# EAGLE design ps2 (EAGLE 7.6.0)
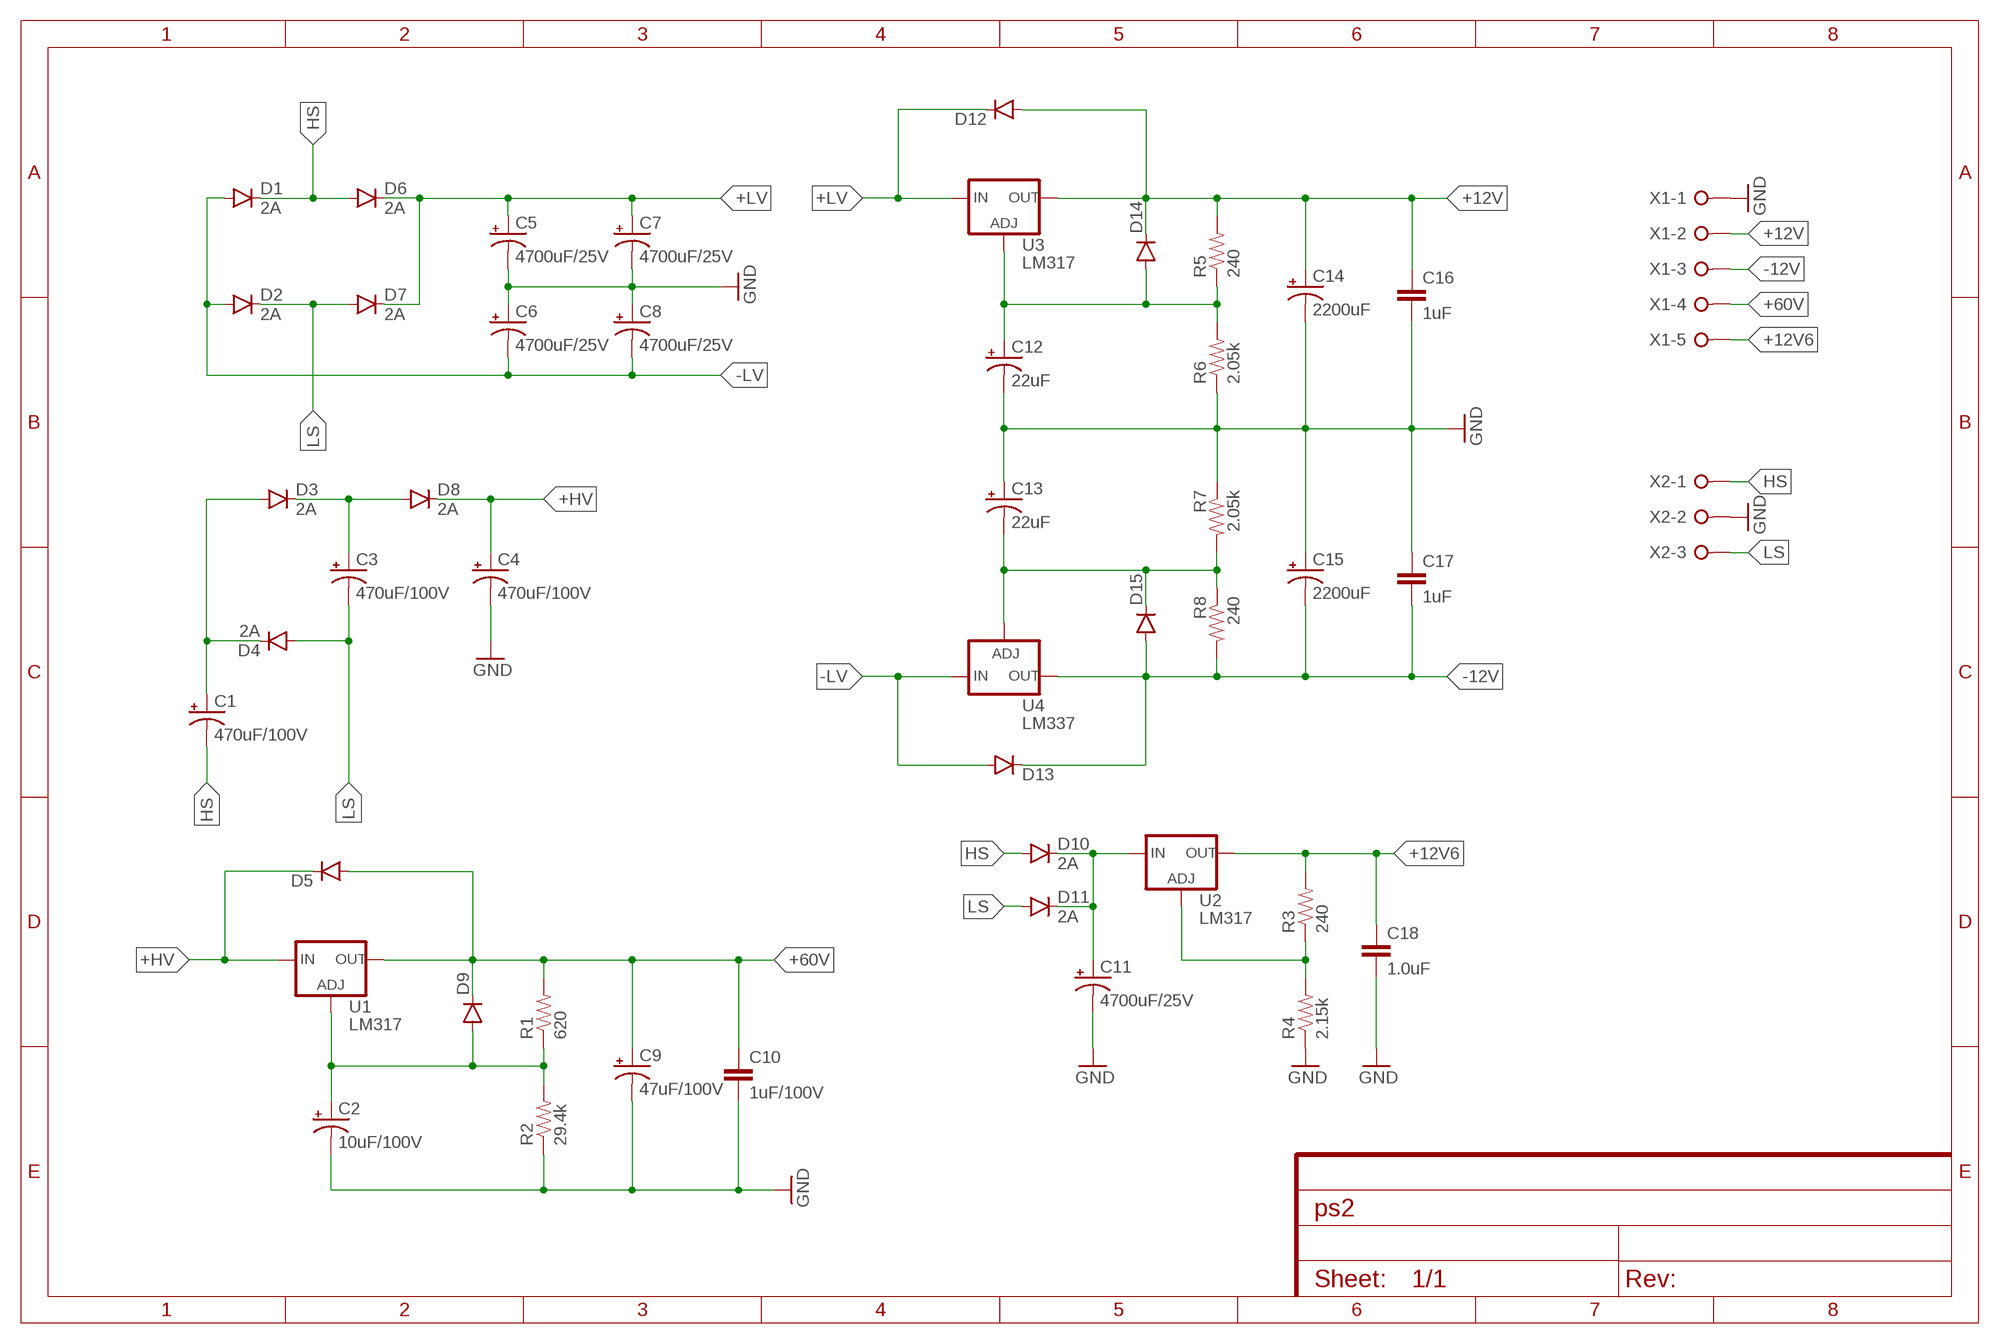
[diagram p0: schematic, sheet 1]

## Parts
C1  470uF/100V  CAP_POLPTH3  [CPOL-RADIAL-1000UF-63V]
C2  10uF/100V  CAP_POLPTH1  [CPOL-RADIAL-100UF-25V]
C3  470uF/100V  CAP_POLPTH3  [CPOL-RADIAL-1000UF-63V]
C4  470uF/100V  CAP_POLPTH3  [CPOL-RADIAL-1000UF-63V]
C5  4700uF/25V  CAP_POLPTH3  [CPOL-RADIAL-1000UF-63V]
C6  4700uF/25V  CAP_POLPTH3  [CPOL-RADIAL-1000UF-63V]
C7  4700uF/25V  CAP_POLPTH3  [CPOL-RADIAL-1000UF-63V]
C8  4700uF/25V  CAP_POLPTH3  [CPOL-RADIAL-1000UF-63V]
C9  47uF/100V  CAP_POLPTH4  [CPOL-RADIAL-1000UF-25V]
C10  1uF/100V  C-EUC1206  [C1206]
C11  4700uF/25V  CAP_POLPTH3  [CPOL-RADIAL-1000UF-63V]
C12  22uF  CAP_POLPTH2  [CPOL-RADIAL-10UF-25V]
C13  22uF  CAP_POLPTH2  [CPOL-RADIAL-10UF-25V]
C14  2200uF  CAP_POLPTH4  [CPOL-RADIAL-1000UF-25V]
C15  2200uF  CAP_POLPTH4  [CPOL-RADIAL-1000UF-25V]
C16  1uF  1UF-25V-10%(0805)"  [0805-CAP]
C17  1uF  1UF-25V-10%(0805)"  [0805-CAP]
C18  1.0uF  1.0UF-25V-+80/-20(0805)"  [0805-CAP]
D1  2A  DIODESMA  [SMA-DIODE]
D2  2A  DIODESMA  [SMA-DIODE]
D3  2A  DIODESMA  [SMA-DIODE]
D4  2A  DIODESMA  [SMA-DIODE]
D5  DIODESMA  [SMA-DIODE]
D6  2A  DIODESMA  [SMA-DIODE]
D7  2A  DIODESMA  [SMA-DIODE]
D8  2A  DIODESMA  [SMA-DIODE]
D9  DIODESMA  [SMA-DIODE]
D10  2A  DIODESMA  [SMA-DIODE]
D11  2A  DIODESMA  [SMA-DIODE]
D12  DIODESMA  [SMA-DIODE]
D13  DIODESMA  [SMA-DIODE]
D14  DIODESMA  [SMA-DIODE]
D15  DIODESMA  [SMA-DIODE]
R1  620  RESISTORPTH-1/4W  [AXIAL-0.4]
R2  29.4k  RESISTORPTH-1/4W  [AXIAL-0.4]
R3  240  RESISTORPTH-1/4W  [AXIAL-0.4]
R4  2.15k  RESISTORPTH-1/4W  [AXIAL-0.4]
R5  240  RESISTORPTH-1/4W  [AXIAL-0.4]
R6  2.05k  RESISTORPTH-1/4W  [AXIAL-0.4]
R7  2.05k  RESISTORPTH-1/4W  [AXIAL-0.4]
R8  240  RESISTORPTH-1/4W  [AXIAL-0.4]
U1  LM317  V_REG_317DPACK  [V-REG_DPACK]
U2  LM317  V_REG_317DPACK  [V-REG_DPACK]
U3  LM317  V_REG_317DPACK  [V-REG_DPACK]
U4  LM337  V_REG_337DPACK  [V-REG_DPACK]
X1  W237-05P  [W237-5P]
X2  W237-3E  [W237-3E]

## Nets
+12V: C14.+ C16.1 D12.A D14.C R5.P$2 U3.4(OUT) X1.2
+12V6: C18.1 R3.P$2 U2.4(OUT) X1.5
+60V: C9.+ C10.1 D5.A D9.C R1.P$2 U1.4(OUT) X1.4
+HV: C4.1(+) D5.C D8.C U1.3(IN)
+LV: C5.1(+) C7.1(+) D6.C D7.C D12.C U3.3(IN)
-12V: C15.- C17.2 D13.C D15.A R8.P$2 U4.3(OUT) X1.3
-LV: C6.2(-) C8.2(-) D1.A D2.A D13.A U4.2(IN)
GND: C2.2(-) C4.2(-) C5.2(-) C6.1(+) C7.2(-) C8.1(+) C9.- C10.2 C11.2(-) C12.2(-) C13.1(+) C14.- C15.+ C16.2 C17.1 C18.2 R2.P$1 R4.P$1 R6.P$1 R7.P$1 X1.1 X2.2
HS: C1.2(-) D1.C D6.A D10.A X2.1
LS: C3.2(-) D2.C D4.A D7.A D11.A X2.3
N$1: C1.1(+) D3.A D4.C
N$2: C3.1(+) D3.C D8.A
N$3: C13.2(-) D15.C R7.P$2 R8.P$1 U4.1(ADJ)
N$4: C12.1(+) D14.A R5.P$1 R6.P$2 U3.1(ADJ)
N$5: C2.1(+) D9.A R1.P$1 R2.P$2 U1.1(ADJ)
N$6: R3.P$1 R4.P$2 U2.1(ADJ)
N$7: C11.1(+) D10.C D11.C U2.3(IN)

## Library data of the parts
C1-C9 C11-C15 = SparkFun-Capacitors:CAP_POL: Capacitor Polarized These are standard SMD and PTH capacitors. Normally 10uF, 47uF, and 100uF in electrolytic and tantalum varieties. Always verify the external diameter of the through hole cap, it varies with capacity, voltage, and manufacturer. The EIA devices should be standard.
C10 = rcl:C-EU: CAPACITOR, European symbol
C16 C17 = SparkFun-Capacitors:1UF-25V-10%(0805): CAP-08064
C18 = SparkFun-Capacitors:1.0UF-25V-+80/-20(0805): CAP-11625; PROD_ID: CAP-11625
D1-D15 = SparkFun-DiscreteSemi:DIODE: Diode These are standard reverse protection diodes and small signal diodes. SMA package can handle up to about 1A. SOD-323 can handle about 200mA. What the SOD-323 package when ordering, there are some mfgs out there that are 5-pin packages.
R1-R8 = SparkFun-Resistors:RESISTOR: Resistor Basic schematic elements and footprints for 0603, 1206, and PTH resistors.
U1-U3 = SparkFun-PowerIC:V_REG_317: Voltage Regulator Standard LM317 adjustable voltage regulator. AOI (Adjust Output Input). Google 'LM317 Calculator' for easy to use app to get the two resistor values needed. 240/720 for 5V output. 240/390 for 3.3V output. Spark Fun Electronics SKU : COM-00527; PROD_ID: IC-09888
U4 = my:V_REG_337: Voltage Regulator Standard LM337 adjustable voltage regulator.; PROD_ID: IC-09888
X1 = con-wago-508:W237-05P: WAGO SREW CLAMP; OC_FARNELL: unknown; OC_NEWARK: unknown
X2 = con-wago-508:W237-3E: WAGO SREW CLAMP; OC_FARNELL: unknown; OC_NEWARK: unknown

## Board
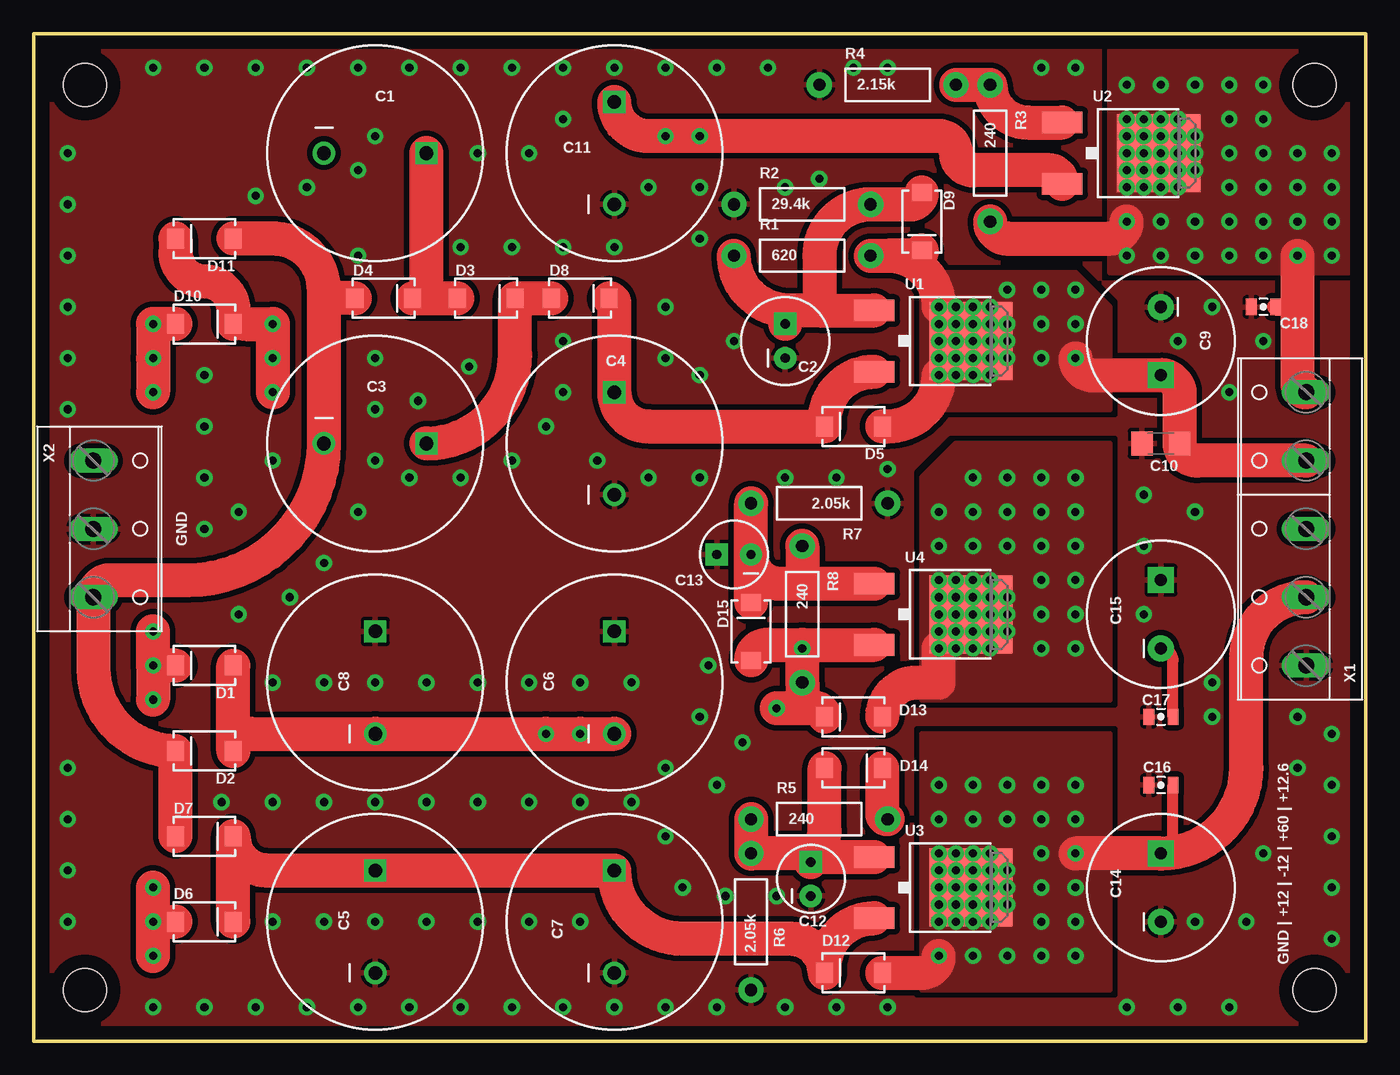
[diagram p1: board, top side]
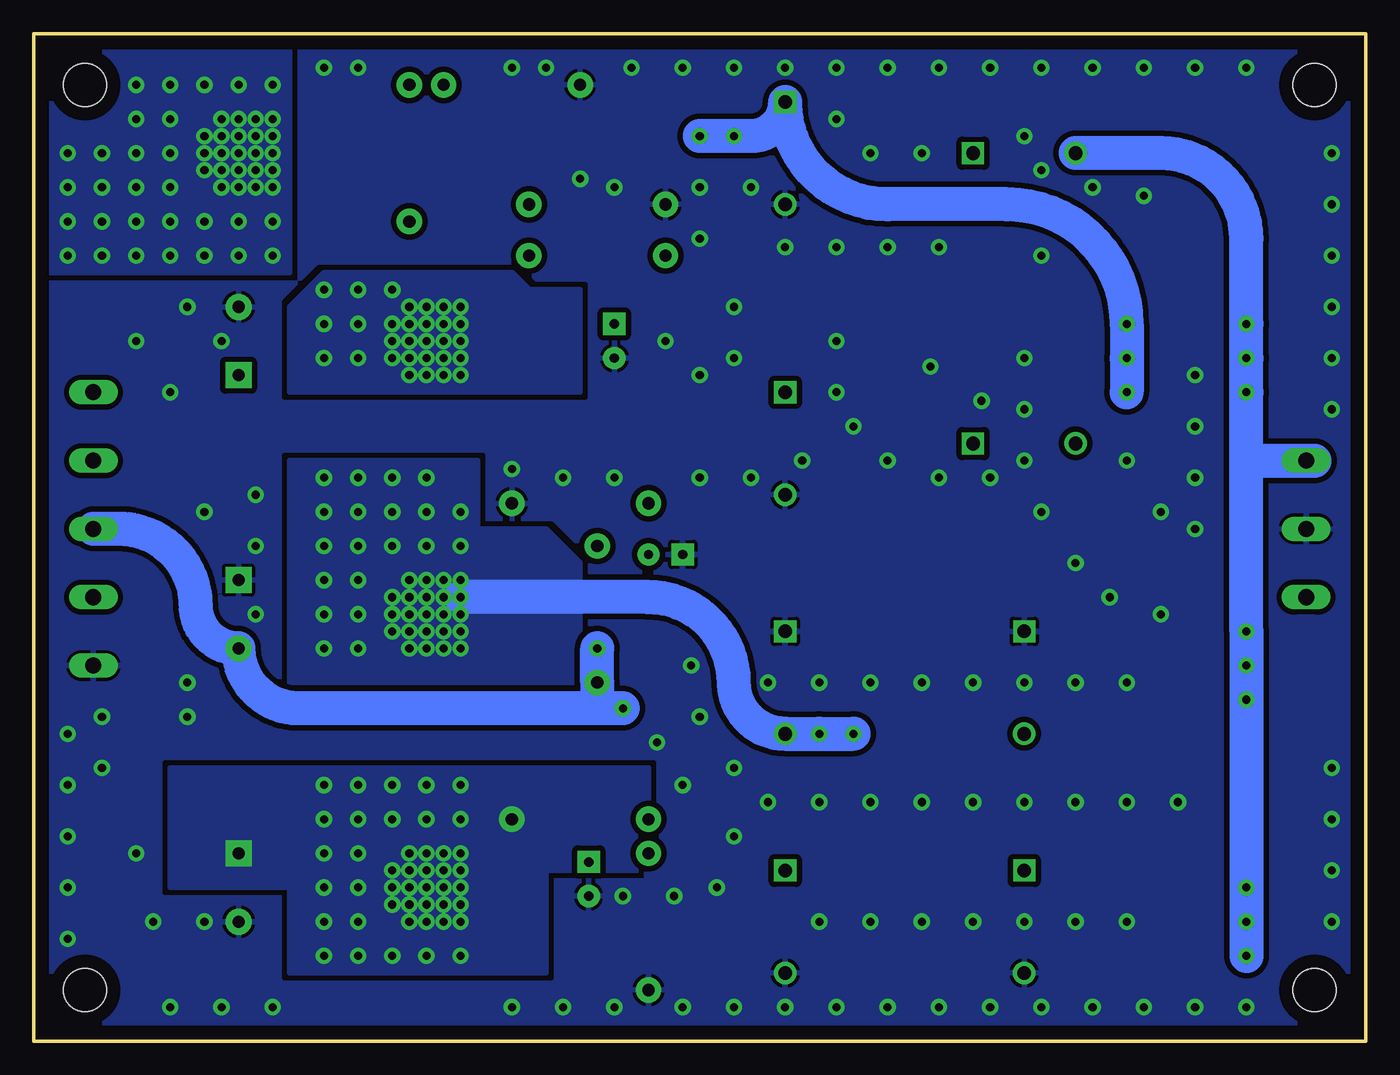
[diagram p2: board, bottom side, seen from below]

Size 99.06 x 74.93 mm. Coordinates in mm from the lower left corner, seen from the top.
Outline: 99.06,0 99.06,74.93 0,74.93 0,0 99.06,0
Copper layers (1*16): Top 0.035mm / dielectric 1.5mm / Bottom 0.035mm
Design rules "default *": minimum track width 12mil, minimum drill 22mil, track to track 12mil, track to pad 12mil, pad to pad 12mil, via to via 12mil, smd to smd 0mil, copper to edge 40mil, drill to drill 12mil, minimum pad ring 12mil, minimum via ring 12mil, stop-mask expansion 4mil, vias tented up to drill 0mil, thermal gap 10mil
Holes 3.2 mm at 3.81,71.12 3.81,3.81 95.25,71.12 95.25,3.81

### Footprints (pad centres in the part's own frame; a part is rotated, then mirrored left to right if it is on the bottom)
CPOL-RADIAL-1000UF-63V = drill 1.016 pad 1.651 square: 1 3.81,0 | drill 1.016 pad 1.676: 2 -3.81,0
CPOL-RADIAL-100UF-25V = drill 0.7 pad 1.651 square: 1 1.27,0 | drill 0.7 pad 1.651: 2 -1.27,0
CPOL-RADIAL-1000UF-25V = drill 0.9 pad 1.93 square: + 2.54,0 | drill 0.9 pad 1.93: - -2.54,0
C1206 = smd 1.6 x 1.8: 1 -1.4,0; 2 1.4,0
CPOL-RADIAL-10UF-25V = drill 0.7 pad 1.651 square: 1 1.27,0 | drill 0.7 pad 1.651: 2 -1.27,0
0805-CAP = smd 0.8 x 1.2: 1 -0.9,0; 2 0.9,0
SMA-DIODE = smd 1.27 x 1.47: A -2.15,0; C 2.15,0
AXIAL-0.4 = drill 0.9 pad 1.88: P$1 -5.08,0; P$2 5.08,0
V-REG_DPACK = smd 1.6 x 3: 1 -2.28,-4.8; 3 2.28,-4.8 | smd 5.8 x 6.2: 4 0,2.38
V-REG_DPACK' = smd 1.6 x 3: 1 -2.28,-4.8; 3 2.28,-4.8 | smd 5.8 x 6.2: 2 0,2.38
W237-5P = drill 1.194 long: 1 -10.16,-0.635; 2 -5.08,-0.635; 3 0,-0.635; 4 5.08,-0.635; 5 10.16,-0.635
W237-3E = drill 1.194 long: 1 -5.08,-0.635; 2 0,-0.635; 3 5.08,-0.635

### Placement (x,y rotation side)
C1  25.4,66.04 0 top
C2  55.88,52.07 90 top
C3  25.4,44.45 0 top
C4  43.18,44.45 90 top
C5  25.4,8.89 90 top
C6  43.18,26.67 90 top
C7  43.18,8.89 90 top
C8  25.4,26.67 90 top
C9  83.82,52.07 270 top
C10  83.82,44.45 180 top
C11  43.18,66.04 90 top
C12  57.78,12.06 90 top
C13  52.07,36.2 180 top
C14  83.82,11.43 90 top
C15  83.82,31.75 90 top
C16  83.82,19.05 180 top
C17  83.82,24.13 0 top
C18  91.44,54.61 180 top
D1  12.7,27.94 180 top
D2  12.7,21.59 180 top
D3  33.66,55.24 0 top
D4  26.04,55.24 0 top
D5  60.96,45.72 180 top
D6  12.7,8.89 0 top
D7  12.7,15.24 0 top
D8  40.64,55.24 0 top
D9  66.04,60.96 270 top
D10  12.7,53.34 0 top
D11  12.7,59.69 180 top
D12  60.96,5.08 180 top
D13  60.96,24.13 180 top
D14  60.96,20.32 0 top
D15  53.34,30.48 90 top
R1  57.15,58.42 0 top
R2  57.15,62.23 0 top
R3  71.12,66.04 270 top
R4  63.5,71.12 0 top
R5  58.42,16.51 0 top
R6  53.34,8.89 90 top
R7  58.42,40.01 180 top
R8  57.15,31.75 270 top
U1  67.31,52.07 270 top
U2  81.28,66.04 270 top
U3  67.31,11.43 270 top
U4  LM337  [V-REG_DPACK']  67.31,31.75 270 top
X1  93.98,38.1 90 top
X2  5.08,38.1 270 top

### Tracks (layer width: path | path; a pad name or v marks a point on that pad's centre or on a via)
+12V  (via drill 0.6)
  Top 0.813: C14.+ arc90 84.72,14.87 C16.1
  Top 2.54: D12.A 66.04,5.08 arc90 v67.31,6.35 | v77.47,13.97 C14.+ arc90 90.17,20.32 90.17,28.57 arc-90 X1.2 | R5.P$2 arc-90 63.11,16.9 D14.C
  other vias: 67.31,13.97 68.58,13.97 69.85,13.97 69.85,12.7 68.58,12.7 67.31,12.7 67.31,11.43 68.58,11.43 69.85,11.43 69.85,10.16 68.58,10.16 67.31,10.16 67.31,8.89 68.58,8.89 69.85,8.89 71.12,8.89 71.12,10.16 71.12,11.43 71.12,12.7 71.12,13.97 72.39,12.7 72.39,11.43 72.39,10.16 67.31,16.51 67.31,19.05 69.85,19.05 69.85,16.51 72.39,16.51 72.39,19.05 74.93,19.05 74.93,16.51 77.47,16.51 77.47,19.05 74.93,13.97 74.93,11.43 74.93,8.89 77.47,8.89 77.47,11.43 74.93,6.35 77.47,6.35 72.39,6.35 69.85,6.35
  pour Bottom (isolate 0.406, no thermals): 88.9,20.32 53.34,20.32 53.34,12.7 60.96,12.7 60.96,5.08 80.01,5.08 80.01,11.43 88.9,11.43
  pour Top (isolate 0.406, no thermals): 66.04,22.86 80.01,22.86 80.01,3.81 66.04,3.81
+12V6  (via drill 0.6)
  Top 1.27: C18.1 93.98,54.61
  Top 2.54: X1.5 arc-90 93.98,48.9 93.98,54.61 v93.98,58.42 | R3.P$2 arc90 72.39,59.69 80.01,59.69 arc90 v81.28,60.96
  other vias: 83.82,66.04 83.82,67.31 83.82,68.58 83.82,64.77 83.82,63.5 82.55,63.5 82.55,64.77 82.55,66.04 82.55,67.31 82.55,68.58 81.28,68.58 81.28,67.31 81.28,66.04 81.28,64.77 81.28,63.5 85.09,63.5 85.09,64.77 85.09,66.04 85.09,67.31 85.09,68.58 86.36,67.31 86.36,66.04 86.36,64.77 81.28,71.12 83.82,71.12 86.36,71.12 88.9,71.12 91.44,71.12 88.9,68.58 91.44,68.58 88.9,66.04 88.9,63.5 88.9,60.96 88.9,58.42 91.44,58.42 91.44,60.96 91.44,63.5 91.44,66.04 93.98,66.04 93.98,63.5 93.98,60.96 96.52,58.42 96.52,60.96 96.52,63.5 96.52,66.04 86.36,58.42 86.36,60.96 83.82,60.96 83.82,58.42 81.28,58.42
  pour Top (isolate 0.406, no thermals): 80.01,74.93 80.01,57.15 99.06,57.15 99.06,74.93
  pour Bottom (isolate 0.406, no thermals): 80.01,74.93 80.01,57.15 99.06,57.15 99.06,74.93
+60V  (via drill 0.6)
  Top 2.54: R1.P$2 63.5,58.42 | 63.5,58.42 arc-90 v67.31,54.61 | D9.C arc-90 65.65,58.42 63.5,58.42 | v77.47,50.8 arc90 78.74,49.53 C9.+ arc-90 85.22,48.13 C10.1 arc90 86.49,43.18 X1.4 | D5.A 63.5,45.72 arc90 v67.31,49.53
  other vias: 67.31,52.07 67.31,53.34 68.58,54.61 68.58,53.34 69.85,53.34 69.85,54.61 71.12,54.61 71.12,53.34 72.39,53.34 72.39,52.07 72.39,50.8 71.12,50.8 71.12,52.07 69.85,52.07 69.85,50.8 68.58,50.8 68.58,52.07 67.31,50.8 68.58,49.53 69.85,49.53 71.12,49.53 74.93,50.8 74.93,53.34 77.47,53.34 77.47,55.88 74.93,55.88 72.39,55.88
  pour Top (isolate 0.406, no thermals): 66.04,46.99 80.01,46.99 80.01,54.61 77.47,57.15 66.04,57.15
  pour Bottom (isolate 0.406, no thermals): 58.42,55.88 58.42,48.26 80.01,48.26 80.01,54.61 77.47,57.15 63.5,57.15 62.23,55.88
+HV
  Top 2.54: U1.3 arc90 58.81,46.09 D5.C 45.72,45.72 arc-90 C4.1 43.18,54.85 arc90 D8.C
+LV
  Top 2.54: D6.C D7.C arc90 17.39,12.7 C5.1 C7.1 arc90 48.26,7.62 56.27,7.62 arc-90 D12.C 58.81,5.45 arc-90 U3.3
-12V  (via drill 0.6)
  Top 0.813: C17.2 84.72,28.31 arc90 C15.-
  Top 2.54: D15.A arc-90 54.48,29.47 57.15,29.47 | 57.15,29.47 U4.3 | 57.15,29.47 v57.15,29.21 R8.P$2 57.15,24.77 | 57.15,24.77 v55.24,24.77 | D13.C arc90 58.17,24.77 57.15,24.77
  Bottom 2.54: v55.24,24.77 57.15,24.77 | 57.15,24.77 79.38,24.77 arc90 C15.- arc90 87,32.38 arc-90 92.71,38.1 X1.3 | v57.15,29.21 R8.P$2 57.15,24.77
-LV  (via drill 0.6)
  Top 2.54: D1.A D2.A arc-90 16.12,22.86 C8.2 v38.1,22.86 v40.64,22.86 C6.2 | D13.A arc-90 65.65,26.67 67.31,26.67 v67.31,29.21
  Bottom 2.54: v38.1,22.86 v40.64,22.86 C6.2 arc90 46.99,26.67 arc-90 53.34,33.02 v67.31,33.02
  other vias: 69.85,34.29 68.58,34.29 68.58,33.02 69.85,33.02 69.85,31.75 68.58,31.75 67.31,31.75 67.31,34.29 67.31,30.48 68.58,29.21 68.58,30.48 69.85,30.48 69.85,29.21 71.12,30.48 71.12,31.75 71.12,33.02 67.31,36.83 67.31,39.37 69.85,41.91 69.85,39.37 69.85,36.83 72.39,36.83 72.39,39.37 72.39,41.91 74.93,41.91 74.93,39.37 74.93,36.83 77.47,36.83 77.47,39.37 77.47,41.91 72.39,33.02 72.39,31.75 72.39,30.48 74.93,29.21 74.93,31.75 74.93,34.29 77.47,34.29 77.47,31.75 77.47,29.21 71.12,34.29 71.12,29.21
  pour Top (isolate 0.406, no thermals): 66.04,25.4 66.04,41.91 68.58,44.45 80.01,44.45 80.01,25.4
  pour Bottom (isolate 0.406, no thermals): 66.04,43.18 66.04,38.1 60.96,38.1 58.42,35.56 58.42,26.67 80.01,26.67 80.01,43.18
GND  (via drill 0.6)
  other vias: 2.54,8.89 2.54,12.7 2.54,16.51 2.54,20.32 2.54,46.99 2.54,50.8 2.54,54.61 2.54,58.42 2.54,62.23 2.54,66.04 8.89,72.39 12.7,72.39 16.51,72.39 20.32,72.39 24.13,72.39 27.94,72.39 31.75,72.39 35.56,72.39 39.37,72.39 43.18,72.39 46.99,72.39 50.8,72.39 54.61,72.39 60.96,72.39 63.5,72.39 74.93,72.39 77.47,72.39 8.89,2.54 12.7,2.54 16.51,2.54 20.32,2.54 24.13,2.54 27.94,2.54 31.75,2.54 35.56,2.54 39.37,2.54 43.18,2.54 46.99,2.54 50.8,2.54 55.88,2.54 59.69,2.54 63.5,2.54 81.28,2.54 85.09,2.54 88.9,2.54 96.52,7.62 96.52,11.43 96.52,15.24 96.52,19.05 96.52,22.86 93.98,24.13 93.98,20.32 91.44,13.97 87.63,24.13 87.63,26.67 82.55,36.83 82.55,40.64 86.36,39.37 82.55,31.75 86.36,8.89 90.17,8.89 40.64,8.89 36.83,8.89 33.02,8.89 29.21,8.89 25.4,8.89 21.59,8.89 17.78,8.89 17.78,17.78 21.59,17.78 13.97,17.78 25.4,17.78 29.21,17.78 33.02,17.78 36.83,17.78 40.64,17.78 44.45,17.78 46.99,15.24 48.26,11.43 51.44,10.79 55.24,10.79 46.99,20.32 49.53,24.13 50.16,27.94 50.8,19.05 52.7,22.23 17.78,26.67 21.59,26.67 25.4,26.67 29.21,26.67 33.02,26.67 36.83,26.67 40.64,26.67 44.45,26.67 15.24,31.75 19.05,33.02 21.59,35.56 24.13,39.37 25.4,43.18 25.4,46.99 25.4,50.8 24.13,58.42 16.51,62.87 20.32,63.5 24.13,64.77 25.4,67.31 28.57,47.62 32.38,50.16 38.1,45.72 35.56,43.18 31.75,41.91 27.94,41.91 39.37,52.07 39.37,48.26 41.91,43.18 45.72,41.91 49.53,41.91 55.88,41.91 59.69,41.91 63.5,42.55 31.75,59.05 35.56,59.05 39.37,59.05 43.18,59.05 46.99,54.61 46.99,50.8 49.53,49.53 52.07,52.07 49.53,59.69 49.53,63.5 55.88,63.5 58.42,64.14 45.72,63.5 33.02,66.04 36.83,66.04 39.37,68.58 12.7,38.1 15.24,39.37 17.78,43.18 12.7,41.91 12.7,45.72 12.7,49.53 91.44,52.07 85.09,52.07 87.63,54.61 88.9,48.26
  pour Top (isolate 0.406, rank 2): 0,0 99.06,0 99.06,74.93 0,74.93
  pour Bottom (isolate 0.406, rank 2): 0,74.93 99.06,74.93 99.06,0 0,0
HS  (via drill 0.6)
  Top 2.54: v8.89,6.35 v8.89,8.89 | v8.89,8.89 v8.89,11.43 | v8.89,8.89 D6.A | D1.C v8.89,27.94 | v8.89,27.94 v8.89,25.4 | v8.89,27.94 v8.89,30.48 | D10.A v8.89,53.34 v8.89,50.8 v8.89,48.26
  Bottom 2.54: v8.89,6.35 v8.89,8.89 v8.89,11.43 v8.89,25.4 v8.89,27.94 v8.89,30.48 8.89,43.18 | 3.81,43.18 X2.1 8.89,43.18 | 8.89,43.18 v8.89,48.26 v8.89,50.8 v8.89,53.34 8.89,59.69 arc-90 15.24,66.04 C1.2
LS
  Top 2.54: D7.A D2.C arc-90 4.45,27.7 X2.3 arc-90 5.71,34.29 11.43,34.29 arc90 C3.2 21.59,55.24 | 21.59,55.24 21.59,55.88 arc90 17.78,59.69 D11.A | D4.A 21.59,55.24
N$1
  Top 2.54: D3.A D4.C arc90 29.21,56.27 C1.1
N$2
  Top 2.54: D8.A D3.C 35.8,51.05 arc-90 C3.1
N$3
  Top 2.54: D15.C C13.2 | C13.2 R7.P$2 | C13.2 arc90 55.51,34.03 57.15,34.03 | 57.15,34.03 U4.1 | R8.P$1 57.15,34.03
N$4
  Top 2.54: U3.1 58.16,13.71 arc90 C12.1 arc90 57.15,13.97 | 57.15,13.97 R6.P$2 R5.P$1 | 57.15,13.97 arc90 58.81,15.63 D14.A
N$5
  Top 2.54: 58.42,54.35 U1.1 | 58.42,54.35 58.42,58.42 arc-90 R2.P$2 65.16,62.23 arc90 D9.A | 58.42,54.35 56.14,54.35 | 56.14,54.35 arc-90 R1.P$1 | C2.1 55.88,54.09 arc-90 56.14,54.35
N$6
  Top 2.54: R4.P$2 R3.P$1 arc90 73.92,68.32 U2.1
N$7  (via drill 0.6)
  Top 2.54: D11.C 10.55,58.66 arc90 12.7,56.52 arc-90 14.85,54.37 | 14.85,54.37 D10.C | 14.85,54.37 arc90 15.88,53.34 v17.78,53.34 v17.78,50.8 v17.78,48.26 | U2.3 arc90 75.47,64.77 69.85,64.77 arc-90 68.58,66.04 arc90 67.31,67.31 v49.53,67.31 v46.99,67.31 45.72,67.31 arc-90 C11.1
  Bottom 2.54: v17.78,48.26 v17.78,50.8 v17.78,53.34 arc-90 26.67,62.23 35.56,62.23 arc90 C11.1 arc90 45.72,67.31 v46.99,67.31 v49.53,67.31

### Text on the board
tPlace: GND | GND | +12 | -12 | +60 | +12.6